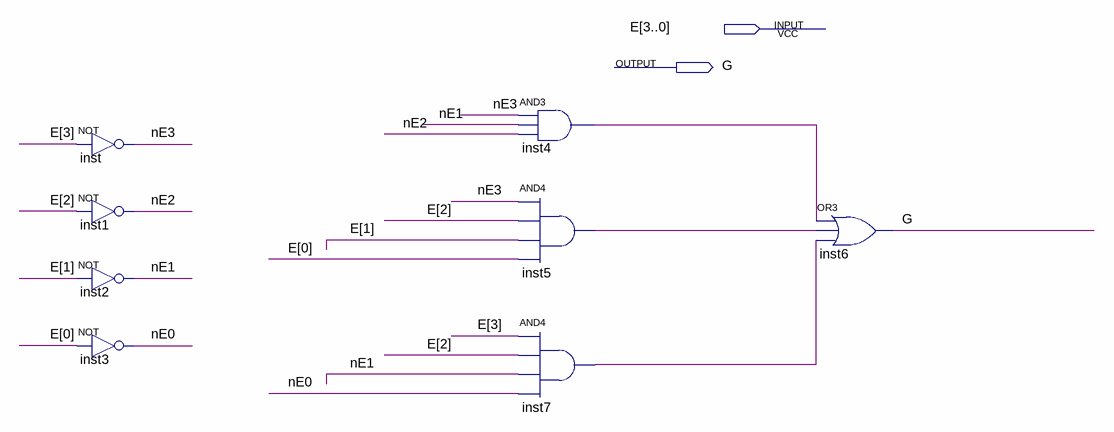
[diagram p0: schematic sheet]
// Quartus schematic displayG.bdf as structural Verilog: 8 symbols, 2 pins
module displayG (
  input  [3:0] E,
  output G
);

  wire inst4_out, inst5_out, inst7_out, nE0, nE1, nE2, nE3;

  not inst (nE3, E[3]);
  not inst1 (nE2, E[2]);
  not inst2 (nE1, E[1]);
  not inst3 (nE0, E[0]);
  and inst4 (inst4_out, nE3, nE1, nE2);
  and inst5 (inst5_out, nE3, E[2], E[1], E[0]);
  and inst7 (inst7_out, E[3], E[2], nE1, nE0);
  or inst6 (G, inst4_out, inst5_out, inst7_out);
endmodule
